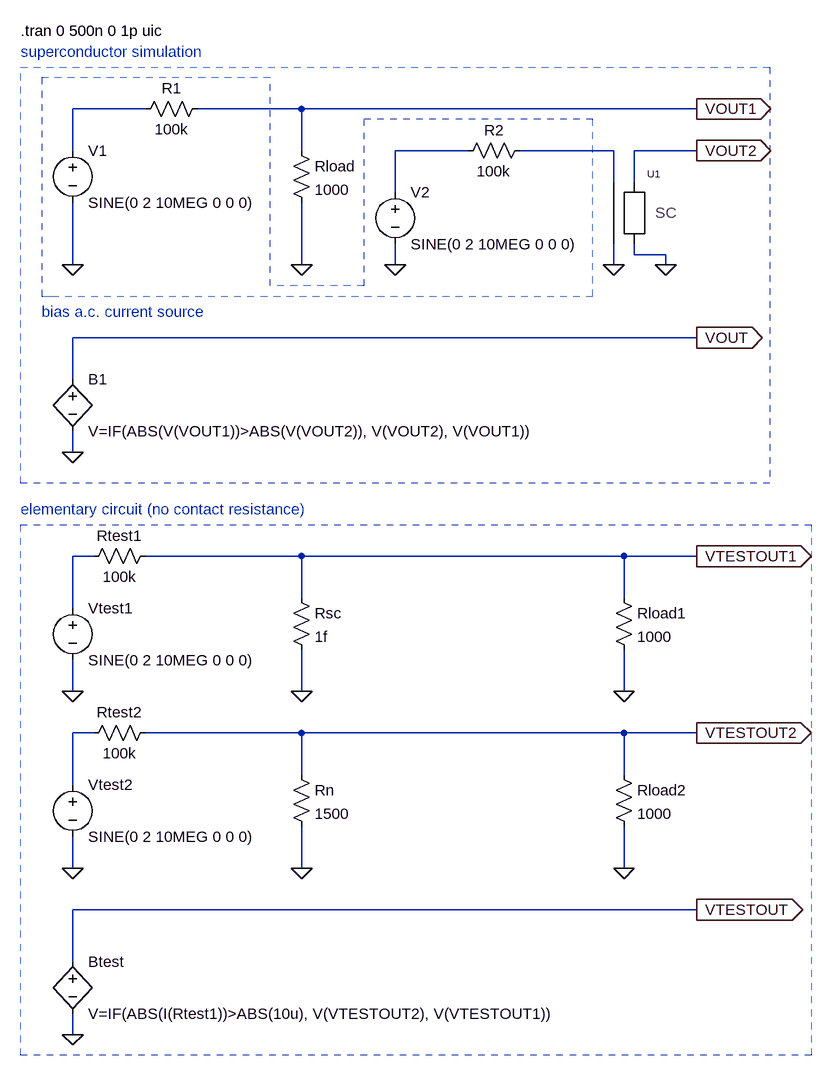
[diagram p0: schematic sc.asc]
sc.asc, the LTspice schematic file:
Version 4
SHEET 1 2688 1492
WIRE 240 32 128 32
WIRE 480 32 320 32
WIRE 1088 32 480 32
WIRE 128 96 128 32
WIRE 480 96 480 32
WIRE 736 96 624 96
WIRE 960 96 816 96
WIRE 1088 96 992 96
WIRE 960 144 960 96
WIRE 992 144 992 96
WIRE 624 160 624 96
WIRE 992 256 992 240
WIRE 1040 256 992 256
WIRE 128 272 128 176
WIRE 480 272 480 176
WIRE 624 272 624 240
WIRE 960 272 960 240
WIRE 1040 272 1040 256
WIRE 1088 384 128 384
WIRE 128 448 128 384
WIRE 128 560 128 528
WIRE 160 720 128 720
WIRE 480 720 240 720
WIRE 976 720 480 720
WIRE 1088 720 976 720
WIRE 480 784 480 720
WIRE 976 784 976 720
WIRE 128 800 128 720
WIRE 128 928 128 880
WIRE 480 928 480 864
WIRE 976 928 976 864
WIRE 160 992 128 992
WIRE 480 992 240 992
WIRE 976 992 480 992
WIRE 1088 992 976 992
WIRE 480 1056 480 992
WIRE 976 1056 976 992
WIRE 128 1072 128 992
WIRE 128 1200 128 1152
WIRE 480 1200 480 1136
WIRE 976 1200 976 1136
WIRE 1088 1264 128 1264
WIRE 128 1344 128 1264
WIRE 128 1456 128 1424
FLAG 128 928 0
FLAG 1088 720 VTESTOUT1
IOPIN 1088 720 Out
FLAG 480 928 0
FLAG 128 1200 0
FLAG 1088 992 VTESTOUT2
IOPIN 1088 992 Out
FLAG 480 1200 0
FLAG 128 1456 0
FLAG 1088 1264 VTESTOUT
IOPIN 1088 1264 Out
FLAG 976 928 0
FLAG 976 1200 0
FLAG 624 272 0
FLAG 128 272 0
FLAG 480 272 0
FLAG 960 272 0
FLAG 1040 272 0
FLAG 1088 32 VOUT1
IOPIN 1088 32 Out
FLAG 1088 96 VOUT2
IOPIN 1088 96 Out
FLAG 128 560 0
FLAG 1088 384 VOUT
IOPIN 1088 384 Out
SYMBOL res 144 736 R270
WINDOW 0 32 56 VTop 2
WINDOW 3 0 56 VBottom 2
SYMATTR InstName Rtest1
SYMATTR Value 100k
SYMBOL voltage 128 784 R0
WINDOW 123 0 0 Left 0
WINDOW 39 0 0 Left 0
SYMATTR InstName Vtest1
SYMATTR Value SINE(0 2 10MEG 0 0 0)
SYMBOL res 464 768 R0
SYMATTR InstName Rsc
SYMATTR Value 1f
SYMBOL res 144 1008 R270
WINDOW 0 32 56 VTop 2
WINDOW 3 0 56 VBottom 2
SYMATTR InstName Rtest2
SYMATTR Value 100k
SYMBOL voltage 128 1056 R0
WINDOW 123 0 0 Left 0
WINDOW 39 0 0 Left 0
SYMATTR InstName Vtest2
SYMATTR Value SINE(0 2 10MEG 0 0 0)
SYMBOL res 464 1040 R0
SYMATTR InstName Rn
SYMATTR Value 1500
SYMBOL bv 128 1328 R0
SYMATTR InstName Btest
SYMATTR Value V=IF(ABS(I(Rtest1))>ABS(10u), V(VTESTOUT2), V(VTESTOUT1))
SYMBOL res 960 768 R0
SYMATTR InstName Rload1
SYMATTR Value 1000
SYMBOL res 960 1040 R0
SYMATTR InstName Rload2
SYMATTR Value 1000
SYMBOL res 336 16 R90
WINDOW 0 0 56 VBottom 2
WINDOW 3 32 56 VTop 2
SYMATTR InstName R1
SYMATTR Value 100k
SYMBOL res 464 80 R0
SYMATTR InstName Rload
SYMATTR Value 1000
SYMBOL voltage 624 144 R0
SYMATTR InstName V2
SYMATTR Value SINE(0 2 10MEG 0 0 0)
SYMBOL res 832 80 R90
WINDOW 0 0 56 VBottom 2
WINDOW 3 32 56 VTop 2
SYMATTR InstName R2
SYMATTR Value 100k
SYMBOL voltage 128 80 R0
SYMATTR InstName V1
SYMATTR Value SINE(0 2 10MEG 0 0 0)
SYMBOL sc 960 192 R0
SYMATTR InstName U1
SYMBOL bv 128 432 R0
SYMATTR InstName B1
SYMATTR Value V=IF(ABS(V(VOUT1))>ABS(V(VOUT2)), V(VOUT2), V(VOUT1))
TEXT 48 -88 Left 2 !.tran 0 500n 0 1p uic
TEXT 80 344 Left 2 ;bias a.c. current source
TEXT 48 -56 Left 2 ;superconductor simulation
TEXT 48 648 Left 2 ;elementary circuit (no contact resistance)
LINE Normal 432 -16 80 -16 1
LINE Normal 432 304 432 -16 1
LINE Normal 576 304 432 304 1
LINE Normal 928 48 576 48 1
LINE Normal 928 320 928 48 1
LINE Normal 96 320 928 320 1
LINE Normal 80 320 96 320 2
LINE Normal 80 -16 80 320 1
LINE Normal 576 304 576 48 1
RECTANGLE Normal 1200 608 48 -32 1
RECTANGLE Normal 1264 1488 48 672 1

The netlist it stands for:
* sc.asc
Rtest1 N004 VTESTOUT1 100k
Vtest1 N004 0 SINE(0 2 10MEG 0 0 0)
Rsc VTESTOUT1 0 1f
Rtest2 N005 VTESTOUT2 100k
Vtest2 N005 0 SINE(0 2 10MEG 0 0 0)
Rn VTESTOUT2 0 1500
Btest VTESTOUT 0 V=IF(ABS(I(Rtest1))>ABS(10u), V(VTESTOUT2), V(VTESTOUT1))
Rload1 VTESTOUT1 0 1000
Rload2 VTESTOUT2 0 1000
R1 VOUT1 N001 100k
Rload VOUT1 0 1000
V2 N002 0 SINE(0 2 10MEG 0 0 0)
R2 N003 N002 100k
V1 N001 0 SINE(0 2 10MEG 0 0 0)
XU1 N003 0 VOUT2 0 superconductor Ic=10u Rsc=1f Rn=1500 Rct=10u  ; pins gate gatereturn n1 n2
B1 VOUT 0 V=IF(ABS(V(VOUT1))>ABS(V(VOUT2)), V(VOUT2), V(VOUT1))
.tran 0 500n 0 1p uic
* bias a.c. current source
* superconductor simulation
* elementary circuit (no contact resistance)
.lib sc.lib
.backanno
.end